# Altium schematic sheet Power + Servo Connections.SchDoc
size A4; SheetNumber: 2; SheetTotal: 2; SPICEModelCacheLTMTQKUW: <root> / <DocumentId>LTMTQKUW</DocumentId> / </root>
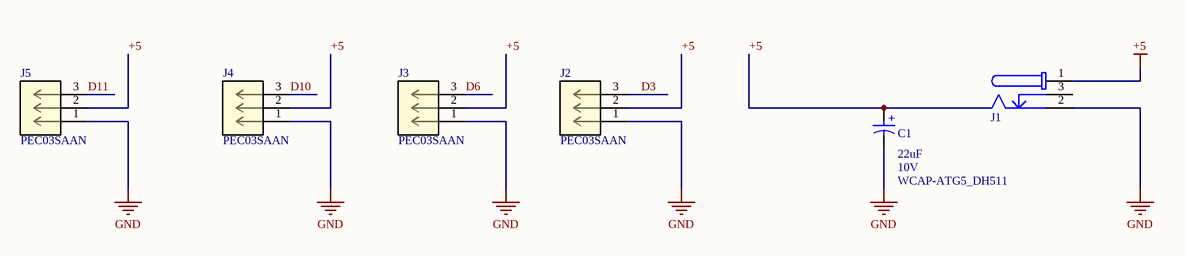
[diagram p0: Power + Servo Connections.SchDoc]

## Parts
C1  22µF  [WCAP-ATG5_D5H11]  (value not drawn)
J1  694102107102  [694102107102]  (value not drawn)
J2  PEC03SAAN  [CONN_PEC03SAAN_SUL]
J3  PEC03SAAN  [CONN_PEC03SAAN_SUL]
J4  PEC03SAAN  [CONN_PEC03SAAN_SUL]
J5  PEC03SAAN  [CONN_PEC03SAAN_SUL]

## Nets
+5: C1.1(P) J1.1 J2.2 J3.2 J4.2 J5.2
GND: C1.2(N) J1.2 J2.1 J3.1 J4.1 J5.1
D3: J2.3
D6: J3.3
D10: J4.3
D11: J5.3

Not connected (* = marked no-connect by the designer): J1 3

## Notes on the sheet
- (near C1) 22uF
- (near C1) 10V
- (near C1) WCAP-ATG5_DH511
- (in symbol 860020272001) +

## Library data of the parts
C1 = 860020272001: WCAP-ATG5 Aluminum Electrolytic Capacitor, Radial, THT, D5 x H11mm, 22µF, 10V; Manufacturer: Wurth Elektronik; Capacitance Tolerance: +/-20%; Dissipation Factor: 17%; Endurance: 2000h; Leakage Current: 3µA; Ripple Current: 45mA; Technical Reference: ATDC110220M010DSPA3B000; Manufacturer Part Number: 860020272001; Category: Aluminum Electrolytic Capacitors; Match Code: WCAP-ATG5; ComponentLink1Description: Website Link; ComponentLink1URL: https://www.we-online.com/redexpert/article/860020272001?ad; ComponentLink2Description: Datasheet Link; ComponentLink2URL: https://www.we-online.com/redexpert/spec/860020272001?ad; Mount: Through Hole; Operating Temperature Max: 105°C; Operating Temperature Min: -40°C; Packaging: Ammo Pack; Height: 11mm; Diameter: 5mm; Capacitance: 22µF; Rated Voltage (DC): 10V
J1 = 694102107102: WR-DC DC Power Jack Connector, Male, Right Angled, 18V, 5A; Manufacturer: Wurth Elektronik; Opening Diameter: 3.9mm; Plug Inner Diameter: 1.05mm; Plug Outer Diameter: 3.5mm; ComponentLink1Description: Website Link; ComponentLink1URL: https://www.we-online.com/redexpert/article/694102107102?ad; ComponentLink2Description: Datasheet Link; ComponentLink2URL: https://www.we-online.com/redexpert/spec/694102107102?ad; Manufacturer Part Number: 694102107102; Category: DC Power Jack Connector; Match Code: WR-DC; Mount: Surface Mount; Operating Temperature Max: 85°C; Operating Temperature Min: -40°C; Packaging: Tape and Reel; Gender: Male; Orientation: Right Angled; Rated Current: 5A; Working Voltage: 18V
J2-J5 = PEC03SAAN: EVKIT PART-CONNECTOR; MALE; THROUGH HOLE; BREAKAWAY;; Manufacturer_Name: Sullins; Copyright: Copyright (C) 2026 Ultra Librarian. All rights reserved.; Manufacturer_Part_Number: PEC03SAAN; RefDes: RefDes; Type: Type